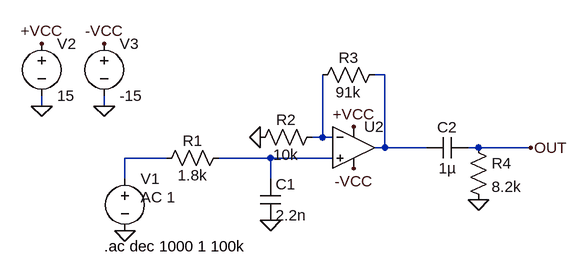
[diagram p0: schematic zad5_lista5.asc]
zad5_lista5.asc, the LTspice schematic file:
Version 4.1
SHEET 1 880 680
WIRE 416 -32 400 -32
WIRE -112 16 -112 0
WIRE -16 16 -16 0
WIRE 320 64 320 -32
WIRE 320 64 304 64
WIRE 336 64 320 64
WIRE 416 80 416 -32
WIRE 416 80 400 80
WIRE 480 80 416 80
WIRE 560 80 544 80
WIRE 640 80 560 80
WIRE 80 96 16 96
WIRE 240 96 160 96
WIRE 336 96 240 96
WIRE 16 128 16 96
WIRE 240 128 240 96
FLAG 16 208 0
FLAG 224 64 0
FLAG 240 192 0
FLAG 560 160 0
FLAG 640 80 OUT
FLAG -16 16 0
FLAG -112 16 0
FLAG -112 -80 +VCC
FLAG 368 48 +VCC
FLAG -16 -80 -VCC
FLAG 368 112 -VCC
SYMBOL voltage 16 112 R0
WINDOW 123 24 44 Left 2
WINDOW 39 0 0 Left 0
SYMATTR Value2 AC 1
SYMATTR InstName V1
SYMATTR Value ""
SYMBOL res 176 80 R90
WINDOW 0 5 56 VBottom 2
WINDOW 3 27 56 VTop 2
SYMATTR InstName R1
SYMATTR Value 1.8k
SYMBOL cap 224 128 R0
SYMATTR InstName C1
SYMATTR Value 2.2n
SYMBOL res 320 48 R90
WINDOW 0 5 56 VBottom 2
WINDOW 3 27 56 VTop 2
SYMATTR InstName R2
SYMATTR Value 10k
SYMBOL res 416 -48 R90
WINDOW 0 5 56 VBottom 2
WINDOW 3 27 56 VTop 2
SYMATTR InstName R3
SYMATTR Value 91k
SYMBOL cap 544 64 R90
WINDOW 0 0 32 VBottom 2
WINDOW 3 32 32 VTop 2
SYMATTR InstName C2
SYMATTR Value 1µ
SYMBOL res 544 64 R0
SYMATTR InstName R4
SYMATTR Value 8.2k
SYMBOL voltage -112 -96 R0
WINDOW 123 0 0 Left 0
WINDOW 39 0 0 Left 0
SYMATTR InstName V2
SYMATTR Value 15
SYMBOL voltage -16 -96 R0
WINDOW 123 0 0 Left 0
WINDOW 39 0 0 Left 0
SYMATTR InstName V3
SYMATTR Value -15
SYMBOL OpAmps\\UniversalOpAmp2 368 80 R0
SYMATTR InstName U2
TEXT -16 232 Left 2 !.ac dec 1000 1 100k

The netlist it stands for:
* zad5_lista5.asc
V1 N003 0 AC 1
R1 N004 N003 1.8k
C1 N004 0 2.2n
R2 N002 0 10k
R3 N001 N002 91k
C2 OUT N001 1µ
R4 OUT 0 8.2k
V2 +VCC 0 15
V3 -VCC 0 -15
X§U2 N004 N002 +VCC -VCC N001 level2 Avol=1Meg GBW=10Meg Slew=10Meg Ilimit=25m Rail=0 Vos=0 En=0 Enk=0 In=0 Ink=0 Rin=500Meg  ; pins In+ In- V+ V- OUT
.ac dec 1000 1 100k
.lib UniversalOpAmp2.lib
.backanno
.end